# Altium project AMC_uBACKPLANE.PrjPcb (part 1 of 4)
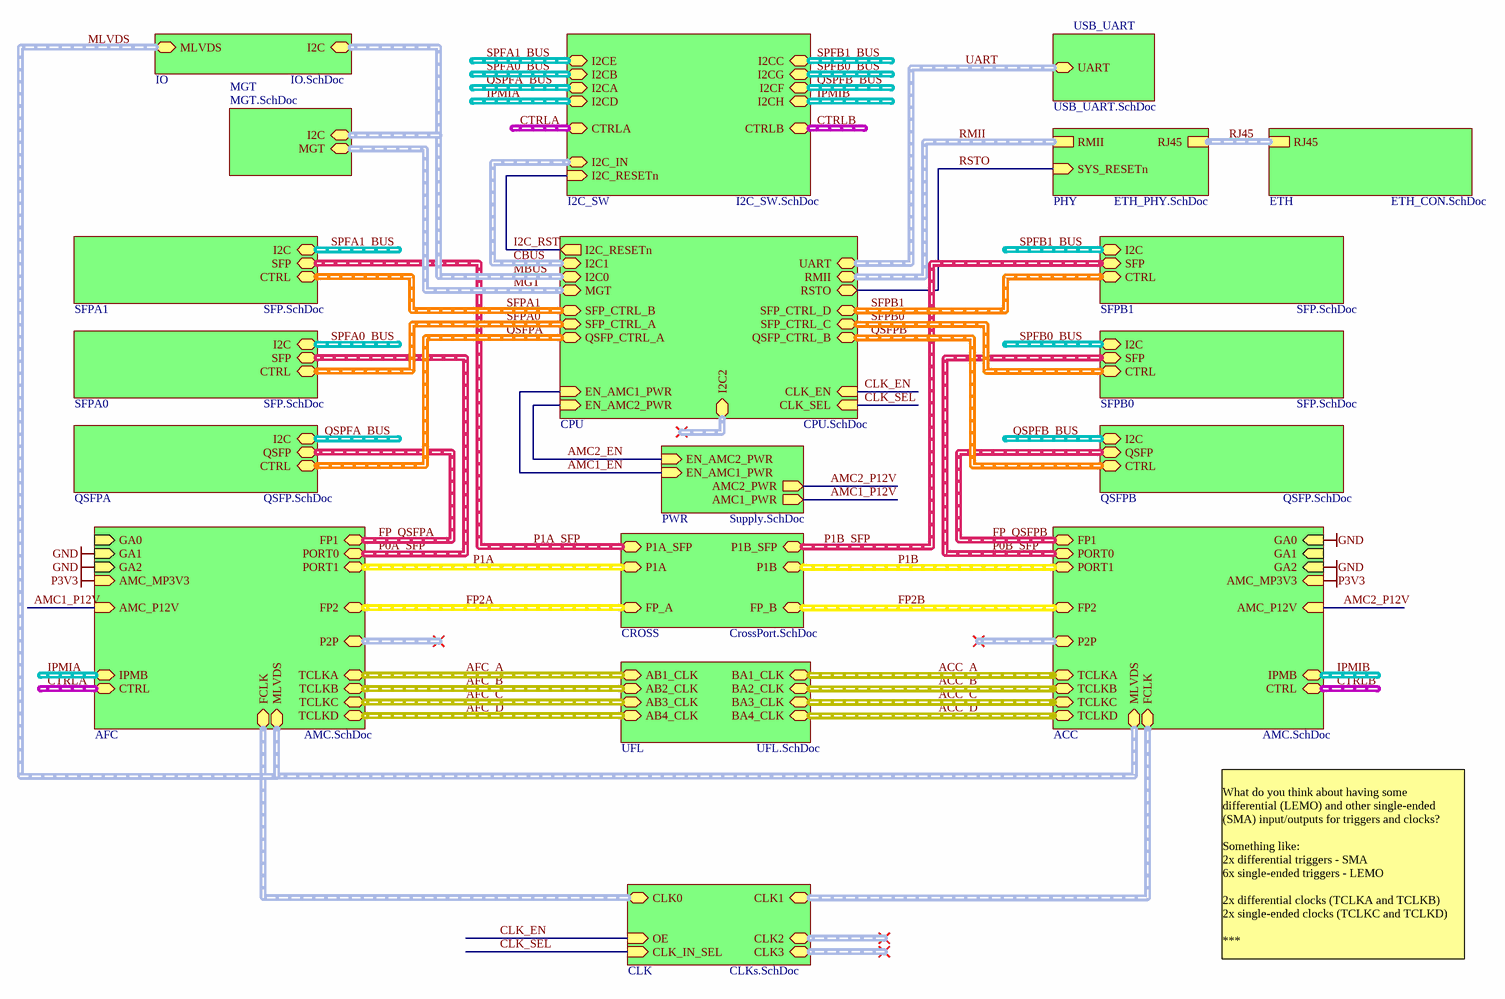
[diagram p0: AMC_uBACKPLANE.SchDoc]
15 sheets, 646 parts. Net scope: hierarchical (ports join the sheet entries above them; power ports are global).
Board file: AMC_uBACKPLANE.PcbDoc
Sheets:
  AMC_uBACKPLANE.SchDoc
    CPU = CPU.SchDoc
    QSFPA = QSFP.SchDoc
    IO = IO.SchDoc
    CLK = CLKs.SchDoc
    QSFPB = QSFP.SchDoc
    SFPA1 = SFP.SchDoc
    ACC = AMC.SchDoc
    AFC = AMC.SchDoc
    SFPA0 = SFP.SchDoc
    SFPB1 = SFP.SchDoc
    SFPB0 = SFP.SchDoc
    UFL = UFL.SchDoc
    CROSS = CrossPort.SchDoc
    PWR = Supply.SchDoc
    USB_UART = USB_UART.SchDoc
    PHY = ETH_PHY.SchDoc
    ETH = ETH_CON.SchDoc
    MGT = MGT.SchDoc
    I2C_SW = I2C_SW.SchDoc

## Sheet AMC_uBACKPLANE.SchDoc: AMC uBACKPLANE
size 420 x 297 mm; Organization: Altium Limited; Address1: L3, 12a Rodborough Rd; Address2: Frenchs Forest; Address3: NSW; Address4: Australia 2086; DocumentNumber: 12; SheetNumber: 1; SheetTotal: 15

### Sub-sheets
ACC = AMC.SchDoc: GA0 (in), GA1 (in), GA2 (in), MLVDS (harness TRG), PORT0 (harness 1xLane), FP2 (harness FP), PORT1 (harness 1xLane), FCLK (harness CLK_DF), TCLKA (harness CLK_DF), TCLKB (harness CLK_DF), TCLKC (harness CLK_DF), TCLKD (harness CLK_DF), FP1 (harness FP), AMC_P12V (in), AMC_MP3V3 (in), IPMB (harness I2C), CTRL (harness AMC_CTRL), P2P (harness P2P)
AFC = AMC.SchDoc: GA0 (in), GA1 (in), GA2 (in), MLVDS (harness TRG), PORT0 (harness 1xLane), FP2 (harness FP), PORT1 (harness 1xLane), FCLK (harness CLK_DF), TCLKA (harness CLK_DF), TCLKB (harness CLK_DF), TCLKC (harness CLK_DF), TCLKD (harness CLK_DF), FP1 (harness FP), AMC_P12V (in), AMC_MP3V3 (in), IPMB (harness I2C), CTRL (harness AMC_CTRL), P2P (harness P2P)
CLK = CLKs.SchDoc: CLK_IN_SEL (in), OE (in), CLK0 (harness CLK_DF), CLK1 (harness CLK_DF), CLK2 (harness CLK_DF), CLK3 (harness CLK_DF)
CPU = CPU.SchDoc: SFP_CTRL_A (harness SFP_CTRL), SFP_CTRL_B (harness SFP_CTRL), SFP_CTRL_C (harness SFP_CTRL), SFP_CTRL_D (harness SFP_CTRL), QSFP_CTRL_A (harness QSFP_CTRL), QSFP_CTRL_B (harness QSFP_CTRL), EN_AMC2_PWR (in), EN_AMC1_PWR (in), CLK_SEL (in), CLK_EN (in), I2C1 (harness I2C), I2C0 (harness I2C), I2C2 (harness I2C), UART (harness UART), RSTO, RMII (harness RMII), MGT (harness THERM_MGT), I2C_RESETn (out)
CROSS = CrossPort.SchDoc: FP_A (harness FP), FP_B (harness FP), P1A (harness 1xLane), P1A_SFP (harness 1xLane), P1B (harness 1xLane), P1B_SFP (harness 1xLane)
ETH = ETH_CON.SchDoc: RJ45 (harness MEDIA)
I2C_SW = I2C_SW.SchDoc: I2C_RESETn (in), I2CE (harness I2C), I2CB (harness I2C), I2CA (harness I2C), I2CD (harness I2C), I2CC (harness I2C), I2CG (harness I2C), I2CF (harness I2C), I2CH (harness I2C), I2C_IN (harness I2C), CTRLA (harness AMC_CTRL), CTRLB (harness AMC_CTRL)
IO = IO.SchDoc: MLVDS (harness MLVDS), I2C (harness I2C)
MGT = MGT.SchDoc: I2C (harness I2C), MGT (harness THERM_MGT)
PHY = ETH_PHY.SchDoc: RMII (harness RMII), RJ45 (harness MEDIA), SYS_RESETn (in)
PWR = Supply.SchDoc: AMC1_PWR (out), AMC2_PWR (out), EN_AMC1_PWR (in), EN_AMC2_PWR (in)
QSFPA = QSFP.SchDoc: I2C (harness I2C), QSFP (harness FP), CTRL (harness QSFP_CTRL)
QSFPB = QSFP.SchDoc: I2C (harness I2C), QSFP (harness FP), CTRL (harness QSFP_CTRL)
SFPA0 = SFP.SchDoc: I2C (harness I2C), SFP (harness 1xLane), CTRL (harness SFP_CTRL)
SFPA1 = SFP.SchDoc: I2C (harness I2C), SFP (harness 1xLane), CTRL (harness SFP_CTRL)
SFPB0 = SFP.SchDoc: I2C (harness I2C), SFP (harness 1xLane), CTRL (harness SFP_CTRL)
SFPB1 = SFP.SchDoc: I2C (harness I2C), SFP (harness 1xLane), CTRL (harness SFP_CTRL)
UFL = UFL.SchDoc: AB1_CLK (harness CLK_DF), BA1_CLK (harness CLK_DF), AB2_CLK (harness CLK_DF), BA2_CLK (harness CLK_DF), AB3_CLK (harness CLK_DF), BA3_CLK (harness CLK_DF), AB4_CLK (harness CLK_DF), BA4_CLK (harness CLK_DF)
USB_UART = USB_UART.SchDoc: UART (harness UART)

### Nets
GND: sheet ACC/GA0, sheet ACC/GA2, sheet AFC/GA1, sheet AFC/GA2
P3V3: sheet ACC/AMC_MP3V3, sheet AFC/AMC_MP3V3
AMC1_EN: sheet CPU/EN_AMC1_PWR, sheet PWR/EN_AMC1_PWR
AMC1_P12V: sheet AFC/AMC_P12V, sheet PWR/AMC1_PWR
AMC2_EN: sheet CPU/EN_AMC2_PWR, sheet PWR/EN_AMC2_PWR
AMC2_P12V: sheet ACC/AMC_P12V, sheet PWR/AMC2_PWR
CLK_EN: sheet CPU/CLK_EN, sheet CLK/OE
CLK_SEL: sheet CPU/CLK_SEL, sheet CLK/CLK_IN_SEL
I2C_RST: sheet CPU/I2C_RESETn, sheet I2C_SW/I2C_RESETn
RSTO: sheet CPU/RSTO, sheet PHY/SYS_RESETn

### Buses and harness runs
harness ACC_A = sheet ACC/TCLKA = sheet UFL/BA1_CLK
harness ACC_B = sheet ACC/TCLKB = sheet UFL/BA2_CLK
harness ACC_C = sheet ACC/TCLKC = sheet UFL/BA3_CLK
harness ACC_D = sheet ACC/TCLKD = sheet UFL/BA4_CLK
harness AFC_A = sheet AFC/TCLKA = sheet UFL/AB1_CLK
harness AFC_B = sheet AFC/TCLKB = sheet UFL/AB2_CLK
harness AFC_C = sheet AFC/TCLKC = sheet UFL/AB3_CLK
harness AFC_D = sheet AFC/TCLKD = sheet UFL/AB4_CLK
harness CBUS = sheet CPU/I2C1 = sheet I2C_SW/I2C_IN
harness CTRLA = sheet AFC/CTRL
harness CTRLA = sheet I2C_SW/CTRLA
harness CTRLB = sheet ACC/CTRL
harness CTRLB = sheet I2C_SW/CTRLB
harness FP2A = sheet AFC/FP2 = sheet CROSS/FP_A
harness FP2B = sheet ACC/FP2 = sheet CROSS/FP_B
harness FP_QSFPA = sheet AFC/FP1 = sheet QSFPA/QSFP
harness FP_QSFPB = sheet ACC/FP1 = sheet QSFPB/QSFP
harness IPMIA = sheet AFC/IPMB
harness IPMIA = sheet I2C_SW/I2CD
harness IPMIB = sheet ACC/IPMB
harness IPMIB = sheet I2C_SW/I2CH
harness MBUS = sheet CPU/I2C0 = sheet IO/I2C = sheet MGT/I2C
harness MGT = sheet CPU/MGT = sheet MGT/MGT
harness MLVDS = sheet ACC/MLVDS = sheet AFC/MLVDS = sheet IO/MLVDS
harness P0A_SFP = sheet AFC/PORT0 = sheet SFPA0/SFP
harness P0B_SFP = sheet ACC/PORT0 = sheet SFPB0/SFP
harness P1A = sheet AFC/PORT1 = sheet CROSS/P1A
harness P1A_SFP = sheet CROSS/P1A_SFP = sheet SFPA1/SFP
harness P1B = sheet ACC/PORT1 = sheet CROSS/P1B
harness P1B_SFP = sheet CROSS/P1B_SFP = sheet SFPB1/SFP
harness QSFPA = sheet CPU/QSFP_CTRL_A = sheet QSFPA/CTRL
harness QSFPB = sheet CPU/QSFP_CTRL_B = sheet QSFPB/CTRL
harness QSPFA_BUS = sheet I2C_SW/I2CA
harness QSPFA_BUS = sheet QSFPA/I2C
harness QSPFB_BUS = sheet I2C_SW/I2CF
harness QSPFB_BUS = sheet QSFPB/I2C
harness RJ45 = sheet ETH/RJ45 = sheet PHY/RJ45
harness RMII = sheet CPU/RMII = sheet PHY/RMII
harness SFPA0 = sheet CPU/SFP_CTRL_A = sheet SFPA0/CTRL
harness SFPA1 = sheet CPU/SFP_CTRL_B = sheet SFPA1/CTRL
harness SFPB0 = sheet CPU/SFP_CTRL_C = sheet SFPB0/CTRL
harness SFPB1 = sheet CPU/SFP_CTRL_D = sheet SFPB1/CTRL
harness sheet ACC/FCLK = sheet CLK/CLK1
harness sheet AFC/FCLK = sheet CLK/CLK0
harness SPFA0_BUS = sheet I2C_SW/I2CB
harness SPFA0_BUS = sheet SFPA0/I2C
harness SPFA1_BUS = sheet I2C_SW/I2CE
harness SPFA1_BUS = sheet SFPA1/I2C
harness SPFB0_BUS = sheet I2C_SW/I2CG
harness SPFB0_BUS = sheet SFPB0/I2C
harness SPFB1_BUS = sheet I2C_SW/I2CC
harness SPFB1_BUS = sheet SFPB1/I2C
harness UART = sheet CPU/UART = sheet USB_UART/UART

### Notes on the sheet
- What do you think about having some differential (LEMO) and other single-ended (SMA) input/outputs for triggers and clocks?
  Something like:
  2x differential triggers - SMA
  6x single-ended triggers - LEMO
  2x differential clocks (TCLKA and TCLKB)
  2x single-ended clocks (TCLKC and TCLKD)
  ***
  Some other things:
  - We can also have access to JTAG and I2C at the front panel.
  - 4x SFP cage could be connected to Port[0..3], as you said before.
  - About the enclosure, do you think it will be needed to design everything, or some parts from Schroff, ELMA, could be used?
- Project/Equipment
- Document
- uTCA RTM 8 SFP+
- Designer
- Drawn by
- Check.by
- Copyright Creotech Instruments SA 2014.
  This documentation describes Open Hardware and is licensed under the CERN OHL v.1.1. You may redistribute and modify this documentation under the terms of the CERN OHL v.1.1. (http://ohwr.org/CERNOHL). This documentation is distributed WITHOUT ANY EXPRESS OR IMPLIED WARRANTY, INCLUDING OF MERCHANTABILITY, SATISFACTORY QUALITY AND FITNESS FOR A PARTICULAR PURPOSE. Please see the CERN OHL v.1.1 for applicable conditions.
- Creotech Instruments S.A.
- File
- Last Mod.
- Print Date
- Sheet
- Size
- A3
- of
- Rev

## Sheet CPU.SchDoc: CPU
size 420 x 297 mm; DocumentNumber: 2; SheetNumber: 3; SheetTotal: 15
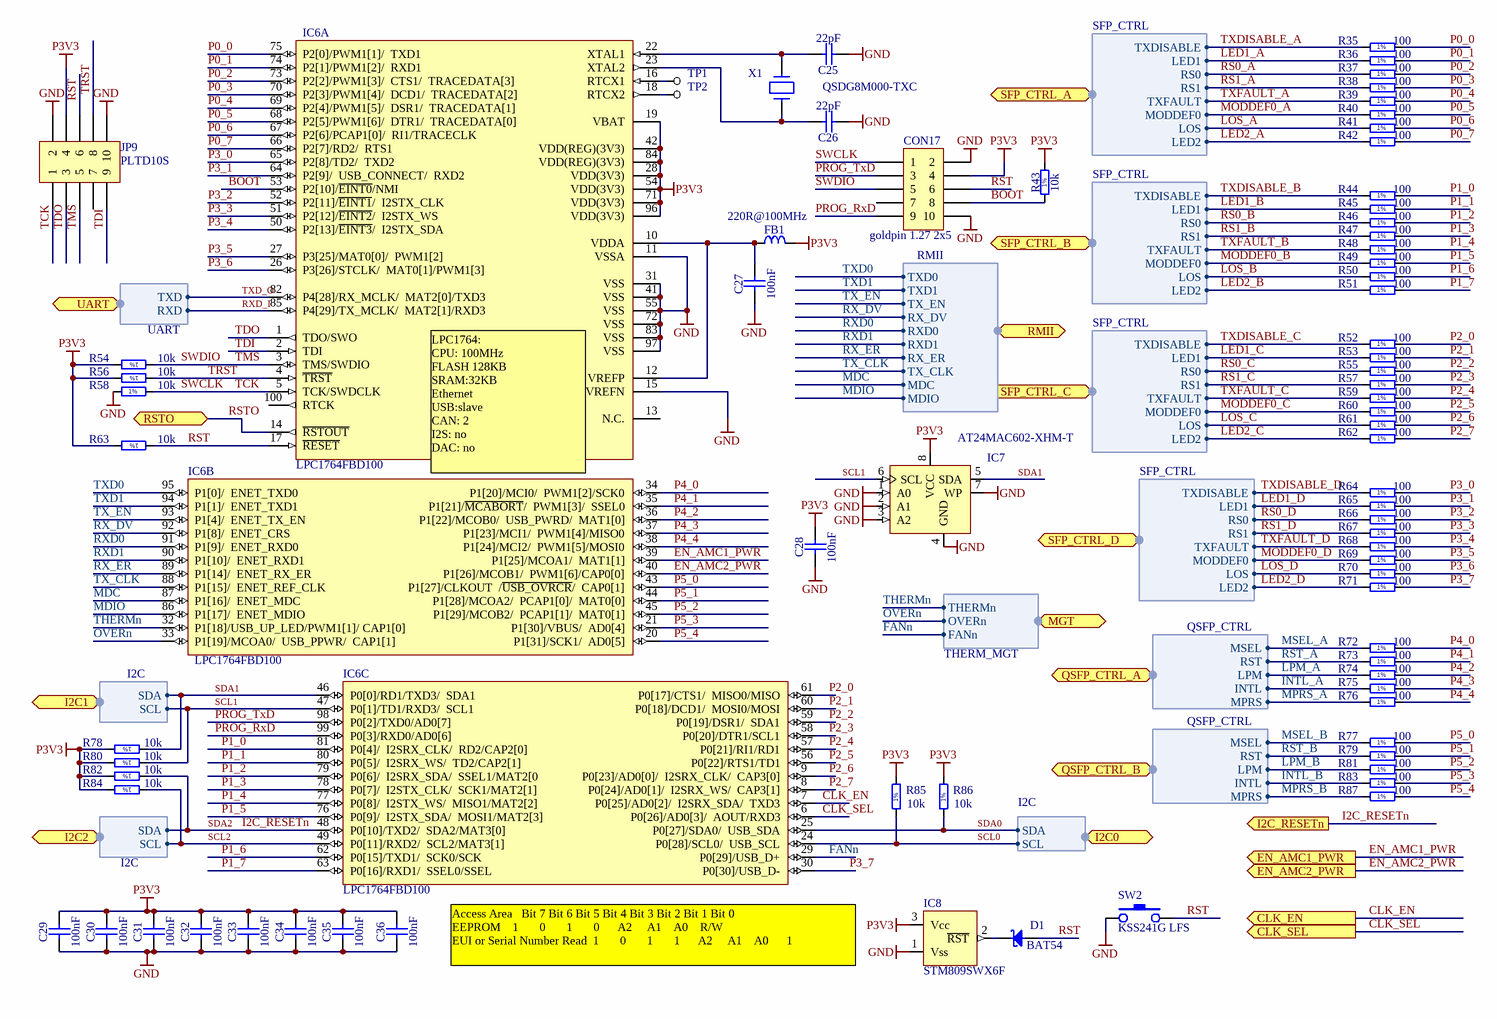
[diagram p1: CPU.SchDoc]

### Parts
C25  22pF  [CAPC1005X55N]
C26  22pF  [CAPC1005X55N]
C27  100nF  [CAPC0603X33N]
C28  100nF  [CAPC0603X33N]
C29  100nF  [CAPC0603X33N]
C30  100nF  [CAPC0603X33N]
C31  100nF  [CAPC0603X33N]
C32  100nF  [CAPC0603X33N]
C33  100nF  [CAPC0603X33N]
C34  100nF  [CAPC0603X33N]
C35  100nF  [CAPC0603X33N]
C36  100nF  [CAPC0603X33N]
CON17  goldpin 1.27 2x5  [CON_2x5_MINI]
D1  BAT54  [SOT95P240X130-3N]
FB1  220R@100MHz  [INDC2012X105N]
IC6  LPC1764FBD100  [LQFP100-LPC]  (parts A,B,C of 3)
IC7  AT24MAC602-XHM-T  [TSSOP-8]
IC8  STM809SWX6F  [SOT-23]
JP9  PLTD10S  [PLTD10S]
R35  100  [RESC1005X40N]
R36  100  [RESC1005X40N]
R37  100  [RESC1005X40N]
R38  100  [RESC1005X40N]
R39  100  [RESC1005X40N]
R40  100  [RESC1005X40N]
R41  100  [RESC1005X40N]
R42  100  [RESC1005X40N]
R43  10k  [RESC1005X40N]
R44  100  [RESC1005X40N]
R45  100  [RESC1005X40N]
R46  100  [RESC1005X40N]
R47  100  [RESC1005X40N]
R48  100  [RESC1005X40N]
R49  100  [RESC1005X40N]
R50  100  [RESC1005X40N]
R51  100  [RESC1005X40N]
R52  100  [RESC1005X40N]
R53  100  [RESC1005X40N]
R54  10k  [RESC1005X40N]
R55  100  [RESC1005X40N]
R56  10k  [RESC1005X40N]
R57  100  [RESC1005X40N]
R58  10k  [RESC1005X40N]
R59  100  [RESC1005X40N]
R60  100  [RESC1005X40N]
R61  100  [RESC1005X40N]
R62  100  [RESC1005X40N]
R63  10k  [RESC1005X40N]
R64  100  [RESC1005X40N]
R65  100  [RESC1005X40N]
R66  100  [RESC1005X40N]
R67  100  [RESC1005X40N]
R68  100  [RESC1005X40N]
R69  100  [RESC1005X40N]
R70  100  [RESC1005X40N]
R71  100  [RESC1005X40N]
R72  100  [RESC1005X40N]
R73  100  [RESC1005X40N]
R74  100  [RESC1005X40N]
R75  100  [RESC1005X40N]
R76  100  [RESC1005X40N]
R77  100  [RESC1005X40N]
R78  10k  [RESC1005X40N]
R79  100  [RESC1005X40N]
R80  10k  [RESC1005X40N]
R81  100  [RESC1005X40N]
R82  10k  [RESC1005X40N]
R83  100  [RESC1005X40N]
R84  10k  [RESC1005X40N]
R85  10k  [RESC1005X40N]
R86  10k  [RESC1005X40N]
R87  100  [RESC1005X40N]
SW2  KSS241G LFS  [KSS241G LFS]
TP1  TP  [TP]  (value not drawn)
TP2  TP  [TP]  (value not drawn)
X1  QSDG8M000-TXC  [XTAL_5.0*3.2]

### Ports
CLK_EN (out), CLK_SEL (out), EN_AMC1_PWR (out), EN_AMC2_PWR (out), I2C0 (harness I2C), I2C1 (harness I2C), I2C2 (harness I2C), I2C_RESETn (out), MGT (harness THERM_MGT), QSFP_CTRL_A (harness QSFP_CTRL), QSFP_CTRL_B (harness QSFP_CTRL), RMII (harness RMII), RSTO, SFP_CTRL_A (harness SFP_CTRL), SFP_CTRL_B (harness SFP_CTRL), SFP_CTRL_C (harness SFP_CTRL), SFP_CTRL_D (harness SFP_CTRL), UART (harness UART)

### Harnesses
I2C: SCL, SDA
UART: RXD, TXD
SFP_CTRL: LED1, TXFAULT, TXDISABLE, MODDEF0, RS0, RS1, LOS, LED2
QSFP_CTRL: RST, MPRS, MSEL, LPM, INTL
RMII: TXD0, TXD1, TX_EN, RX_DV, RXD0, RXD1, RX_ER, TX_CLK, MDC, MDIO
THERM_MGT: OVERn, THERMn, FANn

### Nets
GND: C25.1 C26.1 C27.1 C28.1 C29.1 C30.1 C31.1 C32.1 C33.1 C34.1 C35.1 C36.1 CON17.2 CON17.10 IC6.11(VSSA) IC6.15(VREFN) IC6.31(VSS) IC6.41(VSS) IC6.55(VSS) IC6.72(VSS) IC6.83(VSS) IC6.97(VSS) IC7.1(A0) IC7.2(A1) IC7.3(A2) IC7.4(GND) IC7.7(WP) IC8.1(Vss) JP9.2 JP9.10 R58.1 SW2.1
P3V3: C28.2 C29.2 C30.2 C31.2 C32.2 C33.2 C34.2 C35.2 C36.2 CON17.4 FB1.2 IC6.19(VBAT) IC6.28(VDD(3V3)) IC6.42(VDD(REG)(3V3)) IC6.54(VDD(3V3)) IC6.71(VDD(3V3)) IC6.84(VDD(REG)(3V3)) IC6.96(VDD(3V3)) IC7.8(VCC) IC8.3(Vcc) JP9.4 R43.2 R54.2 R56.2 R63.2 R78.2 R80.2 R82.2 R84.2 R85.2 R86.2
BOOT: CON17.8 IC6.53(P2[10]/~{EINT0}/NMI) R43.1
CLK_EN: IC6.7(P0[25]/AD0[2]/__I2SRX_SDA/__TXD3) ; port CLK_EN
CLK_SEL: IC6.6(P0[26]/AD0[3]/__AOUT/RXD3) ; port CLK_SEL
EN_AMC1_PWR: IC6.39(P1[25]/MCOA1/__MAT1[1]) ; port EN_AMC1_PWR  [project net AMC1_EN]
EN_AMC2_PWR: IC6.40(P1[26]/MCOB1/__PWM1[6]/CAP0[0]) ; port EN_AMC2_PWR  [project net AMC2_EN]
FANn: IC6.29(P0[29]/USB_D+) ; port MGT.FANn  [project net MGT.FANn]
I2C_RESETn: IC6.48(P0[10]/TXD2/__SDA2/MAT3[0]) R82.1 ; port I2C_RESETn, port I2C2.SDA  [also labelled SDA2]  [project net I2C_RST]
INTL_A: R75.1 ; port QSFP_CTRL_A.INTL  [project net QSFPA.INTL]
INTL_B: R83.1 ; port QSFP_CTRL_B.INTL  [project net QSFPB.INTL]
LED1_A: R36.1 ; port SFP_CTRL_A.LED1  [project net SFPA0.LED1]
LED1_B: R45.1 ; port SFP_CTRL_B.LED1  [project net SFPA1.LED1]
LED1_C: R53.1 ; port SFP_CTRL_C.LED1  [project net SFPB0.LED1]
LED1_D: R65.1 ; port SFP_CTRL_D.LED1  [project net SFPB1.LED1]
LED2_A: R42.1 ; port SFP_CTRL_A.LED2  [project net SFPA0.LED2]
LED2_B: R51.1 ; port SFP_CTRL_B.LED2  [project net SFPA1.LED2]
LED2_C: R62.1 ; port SFP_CTRL_C.LED2  [project net SFPB0.LED2]
LED2_D: R71.1 ; port SFP_CTRL_D.LED2  [project net SFPB1.LED2]
LOS_A: R41.1 ; port SFP_CTRL_A.LOS  [project net SFPA0.LOS]
LOS_B: R50.1 ; port SFP_CTRL_B.LOS  [project net SFPA1.LOS]
LOS_C: R61.1 ; port SFP_CTRL_C.LOS  [project net SFPB0.LOS]
LOS_D: R70.1 ; port SFP_CTRL_D.LOS  [project net SFPB1.LOS]
LPM_A: R74.1 ; port QSFP_CTRL_A.LPM  [project net QSFPA.LPM]
LPM_B: R81.1 ; port QSFP_CTRL_B.LPM  [project net QSFPB.LPM]
MDC: IC6.87(P1[16]/__ENET_MDC) ; port RMII.MDC  [project net RMII.MDC]
MDIO: IC6.86(P1[17]/__ENET_MDIO) ; port RMII.MDIO  [project net RMII.MDIO]
MODDEF0_A: R40.1 ; port SFP_CTRL_A.MODDEF0  [project net SFPA0.MODDEF0]
MODDEF0_B: R49.1 ; port SFP_CTRL_B.MODDEF0  [project net SFPA1.MODDEF0]
MODDEF0_C: R60.1 ; port SFP_CTRL_C.MODDEF0  [project net SFPB0.MODDEF0]
MODDEF0_D: R69.1 ; port SFP_CTRL_D.MODDEF0  [project net SFPB1.MODDEF0]
MPRS_A: R76.1 ; port QSFP_CTRL_A.MPRS  [project net QSFPA.MPRS]
MPRS_B: R87.1 ; port QSFP_CTRL_B.MPRS  [project net QSFPB.MPRS]
MSEL_A: R72.1 ; port QSFP_CTRL_A.MSEL  [project net QSFPA.MSEL]
MSEL_B: R77.1 ; port QSFP_CTRL_B.MSEL  [project net QSFPB.MSEL]
OVERn: IC6.33(P1[19]/MCOA0/__USB_PPWR/__CAP1[1]) ; port MGT.OVERn  [project net MGT.OVERn]
P0_0: IC6.75(P2[0]/PWM1[1]/__TXD1) R35.2
P0_1: IC6.74(P2[1]/PWM1[2]/__RXD1) R36.2
P0_2: IC6.73(P2[2]/PWM1[3]/__CTS1/__TRACEDATA[3]) R37.2
P0_3: IC6.70(P2[3]/PWM1[4]/__DCD1/__TRACEDATA[2]) R38.2
P0_4: IC6.69(P2[4]/PWM1[5]/__DSR1/__TRACEDATA[1]) R39.2
P0_5: IC6.68(P2[5]/PWM1[6]/__DTR1/__TRACEDATA[0]) R40.2
P0_6: IC6.67(P2[6]/PCAP1[0]/__RI1/TRACECLK) R41.2
P0_7: IC6.66(P2[7]/RD2/__RTS1) R42.2
P1_0: IC6.81(P0[4]/__I2SRX_CLK/__RD2/CAP2[0]) R44.2
P1_1: IC6.80(P0[5]/__I2SRX_WS/__TD2/CAP2[1]) R45.2
P1_2: IC6.79(P0[6]/__I2SRX_SDA/__SSEL1/MAT2[0) R46.2
P1_3: IC6.78(P0[7]/__I2STX_CLK/__SCK1/MAT2[1]) R47.2
P1_4: IC6.77(P0[8]/__I2STX_WS/__MISO1/MAT2[2]) R48.2
P1_5: IC6.76(P0[9]/__I2STX_SDA/__MOSI1/MAT2[3]) R49.2
P1_6: IC6.62(P0[15]/TXD1/__SCK0/SCK) R50.2
P1_7: IC6.63(P0[16]/RXD1/__SSEL0/SSEL) R51.2
P2_0: IC6.61(P0[17]/CTS1/__MISO0/MISO) R52.2
P2_1: IC6.60(P0[18]/DCD1/__MOSI0/MOSI) R53.2
P2_2: IC6.59(P0[19]/DSR1/__SDA1) R55.2
P2_3: IC6.58(P0[20]/DTR1/SCL1) R57.2
P2_4: IC6.57(P0[21]/RI1/RD1) R59.2
P2_5: IC6.56(P0[22]/RTS1/TD1) R60.2
P2_6: IC6.9(P0[23]/AD0[0]/__I2SRX_CLK/__CAP3[0]) R61.2
P2_7: IC6.8(P0[24]/AD0[1]/__I2SRX_WS/__CAP3[1]) R62.2
P3_0: IC6.65(P2[8]/TD2/__TXD2) R64.2
P3_1: IC6.64(P2[9]/__USB_CONNECT/__RXD2) R65.2
P3_2: IC6.52(P2[11]/~{EINT1}/__I2STX_CLK) R66.2
P3_3: IC6.51(P2[12]/~{EINT2}/__I2STX_WS) R67.2
P3_4: IC6.50(P2[13]/~{EINT3}/__I2STX_SDA) R68.2
P3_5: IC6.27(P3[25]/MAT0[0]/__PWM1[2]) R69.2
P3_6: IC6.26(P3[26]/STCLK/__MAT0[1]/PWM1[3]) R70.2
P3_7: IC6.30(P0[30]/USB_D-) R71.2
P4_0: IC6.34(P1[20]/MCI0/__PWM1[2]/SCK0) R72.2
P4_1: IC6.35(P1[21]/~{MCABORT}/__PWM1[3]/__SSEL0) R73.2
P4_2: IC6.36(P1[22]/MCOB0/__USB_PWRD/__MAT1[0]) R74.2
P4_3: IC6.37(P1[23]/MCI1/__PWM1[4]/MISO0) R75.2
P4_4: IC6.38(P1[24]/MCI2/__PWM1[5]/MOSI0) R76.2
P5_0: IC6.43(P1[27]/CLKOUT__/~{USB_OVRCR}/__CAP0[1]) R77.2
P5_1: IC6.44(P1[28]/MCOA2/__PCAP1[0]/__MAT0[0]) R79.2
P5_2: IC6.45(P1[29]/MCOB2/__PCAP1[1]/__MAT0[1]) R81.2
P5_3: IC6.21(P1[30]/VBUS/__AD0[4]) R83.2
P5_4: IC6.20(P1[31]/SCK1/__AD0[5]) R87.2
PROG_RxD: CON17.9 IC6.99(P0[3]/RXD0/AD0[6])
PROG_TxD: CON17.3 IC6.98(P0[2]/TXD0/AD0[7])
RS0_A: R37.1 ; port SFP_CTRL_A.RS0  [project net SFPA0.RS0]
RS0_B: R46.1 ; port SFP_CTRL_B.RS0  [project net SFPA1.RS0]
RS0_C: R55.1 ; port SFP_CTRL_C.RS0  [project net SFPB0.RS0]
RS0_D: R66.1 ; port SFP_CTRL_D.RS0  [project net SFPB1.RS0]
RS1_A: R38.1 ; port SFP_CTRL_A.RS1  [project net SFPA0.RS1]
RS1_B: R47.1 ; port SFP_CTRL_B.RS1  [project net SFPA1.RS1]
RS1_C: R57.1 ; port SFP_CTRL_C.RS1  [project net SFPB0.RS1]
RS1_D: R67.1 ; port SFP_CTRL_D.RS1  [project net SFPB1.RS1]
RST: CON17.6 D1.1(A) IC6.17(~{RESET}) JP9.6 R63.1 SW2.2
RST_A: R73.1 ; port QSFP_CTRL_A.RST  [project net QSFPA.RST]
RST_B: R79.1 ; port QSFP_CTRL_B.RST  [project net QSFPB.RST]
RSTO: IC6.14(~{RSTOUT}) ; port RSTO
RX_DV: IC6.92(P1[8]/__ENET_CRS) ; port RMII.RX_DV  [project net RMII.RX_DV]
RX_ER: IC6.89(P1[14]/__ENET_RX_ER) ; port RMII.RX_ER  [project net RMII.RX_ER]
RXD0: IC6.91(P1[9]/__ENET_RXD0) ; port RMII.RXD0  [project net RMII.RXD0]
RXD1: IC6.90(P1[10]/__ENET_RXD1) ; port RMII.RXD1  [project net RMII.RXD1]
RXD_I: IC6.85(P4[29]/TX_MCLK/__MAT2[1]/RXD3) ; port UART.RXD  [project net UART.RXD]
SCL0: IC6.24(P0[28]/SCL0/__USB_SCL) R85.1 ; port I2C0.SCL  [project net MBUS.SCL]
SCL1: IC6.47(P0[1]/TD1/RXD3/__SCL1) IC7.6(SCL) R80.1 ; port I2C1.SCL  [project net CBUS.SCL]
SCL2: IC6.49(P0[11]/RXD2/__SCL2/MAT3[1]) R84.1 ; port I2C2.SCL
SDA0: IC6.25(P0[27]/SDA0/__USB_SDA) R86.1 ; port I2C0.SDA  [project net MBUS.SDA]
SDA1: IC6.46(P0[0]/RD1/TXD3/__SDA1) IC7.5(SDA) R78.1 ; port I2C1.SDA  [project net CBUS.SDA]
SWCLK: CON17.1 IC6.5(TCK/SWDCLK) JP9.1 R58.2  [also labelled TCK]
SWDIO: CON17.5 IC6.3(TMS/SWDIO) JP9.5 R54.1  [also labelled TMS]
TDI: IC6.2(TDI) JP9.9
TDO: IC6.1(TDO/SWO) JP9.3
THERMn: IC6.32(P1[18]/USB_UP_LED/PWM1[1]/_CAP1[0]) ; port MGT.THERMn  [project net MGT.THERMn]
TRST: IC6.4(~{TRST}) JP9.8 R56.1
TX_CLK: IC6.88(P1[15]/__ENET_REF_CLK) ; port RMII.TX_CLK  [project net RMII.TX_CLK]
TX_EN: IC6.93(P1[4]/__ENET_TX_EN) ; port RMII.TX_EN  [project net RMII.TX_EN]
TXD0: IC6.95(P1[0]/__ENET_TXD0) ; port RMII.TXD0  [project net RMII.TXD0]
TXD1: IC6.94(P1[1]/__ENET_TXD1) ; port RMII.TXD1  [project net RMII.TXD1]
TXD_O: IC6.82(P4[28]/RX_MCLK/__MAT2[0]/TXD3) ; port UART.TXD  [project net UART.TXD]
TXDISABLE_A: R35.1 ; port SFP_CTRL_A.TXDISABLE  [project net SFPA0.TXDISABLE]
TXDISABLE_B: R44.1 ; port SFP_CTRL_B.TXDISABLE  [project net SFPA1.TXDISABLE]
TXDISABLE_C: R52.1 ; port SFP_CTRL_C.TXDISABLE  [project net SFPB0.TXDISABLE]
TXDISABLE_D: R64.1 ; port SFP_CTRL_D.TXDISABLE  [project net SFPB1.TXDISABLE]
TXFAULT_A: R39.1 ; port SFP_CTRL_A.TXFAULT  [project net SFPA0.TXFAULT]
TXFAULT_B: R48.1 ; port SFP_CTRL_B.TXFAULT  [project net SFPA1.TXFAULT]
TXFAULT_C: R59.1 ; port SFP_CTRL_C.TXFAULT  [project net SFPB0.TXFAULT]
TXFAULT_D: R68.1 ; port SFP_CTRL_D.TXFAULT  [project net SFPB1.TXFAULT]
NetC25_2: C25.2 IC6.22(XTAL1) X1.1
NetC26_2: C26.2 IC6.23(XTAL2) X1.2
NetC27_2: C27.2 FB1.1 IC6.10(VDDA) IC6.12(VREFP)
NetD1_3: D1.3(C) IC8.2(~{RST})
NetIC6_16: IC6.16(RTCX1) TP1.1
NetIC6_18: IC6.18(RTCX2) TP2.1

Not connected (* = marked no-connect by the designer): CON17 7; IC6 13(N.C.) 100(RTCK); JP9 7

### Notes on the sheet
- (near IC6) LPC1764:
  CPU: 100MHz
  FLASH 128KB
  SRAM:32KB
  Ethernet
  USB:slave
  CAN: 2
  I2S: no
  DAC: no
- Access Area 		Bit 7 Bit 6 Bit 5 Bit 4 Bit 3 Bit 2 Bit 1 Bit 0
  EEPROM 			1       0       1       0      A2     A1    A0    R/W
  EUI or Serial Number Read 	1       0       1       1      A2     A1    A0      1
- Project/Equipment
- Document
- uTCA RTM 8 SFP+
- Designer
- Drawn by
- Check.by
- Copyright Creotech Instruments SA 2014.
  This documentation describes Open Hardware and is licensed under the CERN OHL v.1.1. You may redistribute and modify this documentation under the terms of the CERN OHL v.1.1. (http://ohwr.org/CERNOHL). This documentation is distributed WITHOUT ANY EXPRESS OR IMPLIED WARRANTY, INCLUDING OF MERCHANTABILITY, SATISFACTORY QUALITY AND FITNESS FOR A PARTICULAR PURPOSE. Please see the CERN OHL v.1.1 for applicable conditions.
- Creotech Instruments S.A.
- File
- Last Mod.
- Print Date
- Sheet
- Size
- A3
- of
- Rev
- (in symbol R0402_10K_1%_0.0625W_100PPM) 1%
- (in symbol R0402_100R_1%_0.0625W_100PPM) 1%

### Library data of the parts
C25 C26 = CC0402_22PF_50V_5%_NP0: Non-polarised capacitor; Part Description: SMD Multilayer Chip Ceramic Capacitor; Manufacturer: GENERIC; Manufacturer1 Part Number: 223886915229; Voltage: 50V; TC: NP0; Tolerance: ±5%; Table: Capacitors SMD; Part Number: CC0402_22PF_50V_5%_NP0; Component Kind: Standard; Component Type: Standard; Pin Count: 2; Value: 22pF; Status: Not Recommended; Manufacturer Part Number: CC0402_22PF_50V_5%_NP0; Case: 0402; Mounted: Yes; Socket: No; SMD: Yes; Manufacturer1 Example: PHYCOMP; Manufacturer1 ComponentHeight: 0.55mm; HelpURL: \\cern.ch\dfs\Applications\Altium\Datasheets\CC0402_NP0_PHYCOMP.pdf; Author: CERN DEM JLC; CreateDate: 2007-12-03; LatestRevisionDate: 2007-12-03
C27-C36 = CC0201_100NF_6.3V_10%_X5R: Non-polarised capacitor; Part Description: SMD Multilayer Chip Ceramic Capacitor; Manufacturer: GENERIC; Manufacturer1 Part Number: 02016D104KAT2A; Voltage: 6.3V; TC: X5R; Tolerance: ±10%; Table: Capacitors SMD; Part Number: CC0201_100NF_6.3V_10%_X5R; Component Kind: Standard; Component Type: Standard; Pin Count: 2; Value: 100nF; Status: Not Recommended; Manufacturer Part Number: CC0201_100NF_6.3V_10%_X5R; Case: 0201; Mounted: Yes; Socket: No; SMD: Yes; Manufacturer1 Example: AVX; Manufacturer1 ComponentHeight: 0.33mm; HelpURL: \\cern.ch\dfs\Applications\Altium\Datasheets\CC0201_X5R_AVX.pdf; Author: CERN DEM JLC; CreateDate: 2007-12-03; LatestRevisionDate: 2007-12-03
CON17 = CON_HEADER 5X2: PBTD10S
D1 = BAT54: Diode Schottky  Anode Pin 1 Cathode Pin 3 (Pas de pin 2); Part Description: Single Small Signal Schottky Diode; Manufacturer: FAIRCHILD SEMICONDUCTOR; Voltage: 30V; Power: 200mA; Table: Diodes; Part Number: BAT54; Component Kind: Standard; Component Type: Standard; Device: BAT54; PackageDescription: SOT23 3-Leads, Pitch 0.95mm - Body 1.3x2.9mm, IPC Medium Density; Manufacturer Part Number: BAT54; Pin Count: 3; Case: SOT23-3; Mounted: Yes; Socket: No; SMD: Yes; ComponentHeight: 1.30mm; HelpURL: \\cern.ch\dfs\Applications\Altium\Datasheets\BAT54.pdf; Author: CERN DEM JLC; CreateDate: 2009-09-17; LatestRevisionDate: 2010-05-27
FB1 = IND0805_MURATA_BLM21PG221SN1D: Inductor; Part Description: SMD EMIFIL Suppression Chip Ferrite Bead; Manufacturer: MURATA; Power: 2A; Resistance: 0.05R; Tolerance: ±25%; Table: Inductors SMD; Part Number: IND0805_MURATA_BLM21PG221SN1D; Component Kind: Standard; Component Type: Standard; Pin Count: 2; Value: 220R@100MHz; Status: None; Manufacturer Part Number: BLM21PG221SN1D; Case: 0805; Mounted: Yes; Socket: No; SMD: Yes; ComponentHeight: 1.05mm; HelpURL: \\cern.ch\dfs\Applications\Altium\Datasheets\IND0402_MURATA_BLM21P.pdf; Author: CERN DEM JLC; CreateDate: 2010-01-25; LatestRevisionDate: 2010-01-25
IC6 = UPC_LPC1764: ARM Cortex-M3 procesor
IC7 = MEM_24MAC602: Serial 2K EEPROM+ 48bit MAC
IC8 = VMON_STM809: 2.93V  Reset circuit
JP9 = CON_2x5 2.54 male SMT: Goldpin 2.54mm, male header
R35-R42 R44-R53 R55 R57 R59-R62 R64-R77 R79 R81 R83 R87 = R0402_100R_1%_0.0625W_100PPM: Resistor - 1%; Part Description: General Purpose Thick Film Chip Resistor; Manufacturer: GENERIC; Manufacturer1 Part Number: 232270671001L; TC: ±100ppm/°C; Table: Resistors SMD; Part Number: R0402_100R_1%_0.0625W_100PPM; Component Kind: Standard; Component Type: Standard; Pin Count: 2; Value: 100; Status: Not recommended; Power: 0.0625W; Tolerance: ±1%; Manufacturer Part Number: R0402_100R_1%_0.0625W_100PPM; Case: 0402; Mounted: Yes; Socket: No; SMD: Yes; Manufacturer1 Example: YAGEO PHYCOMP; Manufacturer1 ComponentHeight: 0.4mm; HelpURL: \\cern.ch\dfs\Applications\Altium\Datasheets\R0402_Phycomp_RC0402.pdf; Author: CERN DEM JLC; CreateDate: 2007-12-03; LatestRevisionDate: 2012-10-17
R43 R54 R56 R58 R63 R78 R80 R82 R84-R86 = R0402_10K_1%_0.0625W_100PPM: Resistor - 1%; Part Description: General Purpose Thick Film Chip Resistor; Manufacturer: GENERIC; Manufacturer1 Part Number: 232270671003L; TC: ±100ppm/°C; Table: Resistors SMD; Part Number: R0402_10K_1%_0.0625W_100PPM; Component Kind: Standard; Component Type: Standard; Pin Count: 2; Value: 10k; Status: Not recommended; Power: 0.0625W; Tolerance: ±1%; Manufacturer Part Number: R0402_10K_1%_0.0625W_100PPM; Case: 0402; Mounted: Yes; Socket: No; SMD: Yes; Manufacturer1 Example: YAGEO PHYCOMP; Manufacturer1 ComponentHeight: 0.4mm; HelpURL: \\cern.ch\dfs\Applications\Altium\Datasheets\R0402_Phycomp_RC0402.pdf; Author: CERN DEM JLC; CreateDate: 2007-12-03; LatestRevisionDate: 2012-10-17
SW2 = SW-TACT_SMD_RA_mini: Push button; Supplier 1: Farnell; Supplier Part Number 1: 1437640
TP1 TP2 = TP: Testpoint
X1 = X_CRYSTAL_SMD_5.0*3.2: miniature crystal oscillator (Maritex) QSDG8M000-TXC

## Sheet QSFP.SchDoc: QSFP
size 420 x 297 mm; DocumentNumber: 8; SheetNumber: 4; SheetTotal: 15
Used 2 times, as channels QSFPA, QSFPB. Parts and nets are listed once, with the designators drawn on the sheet.
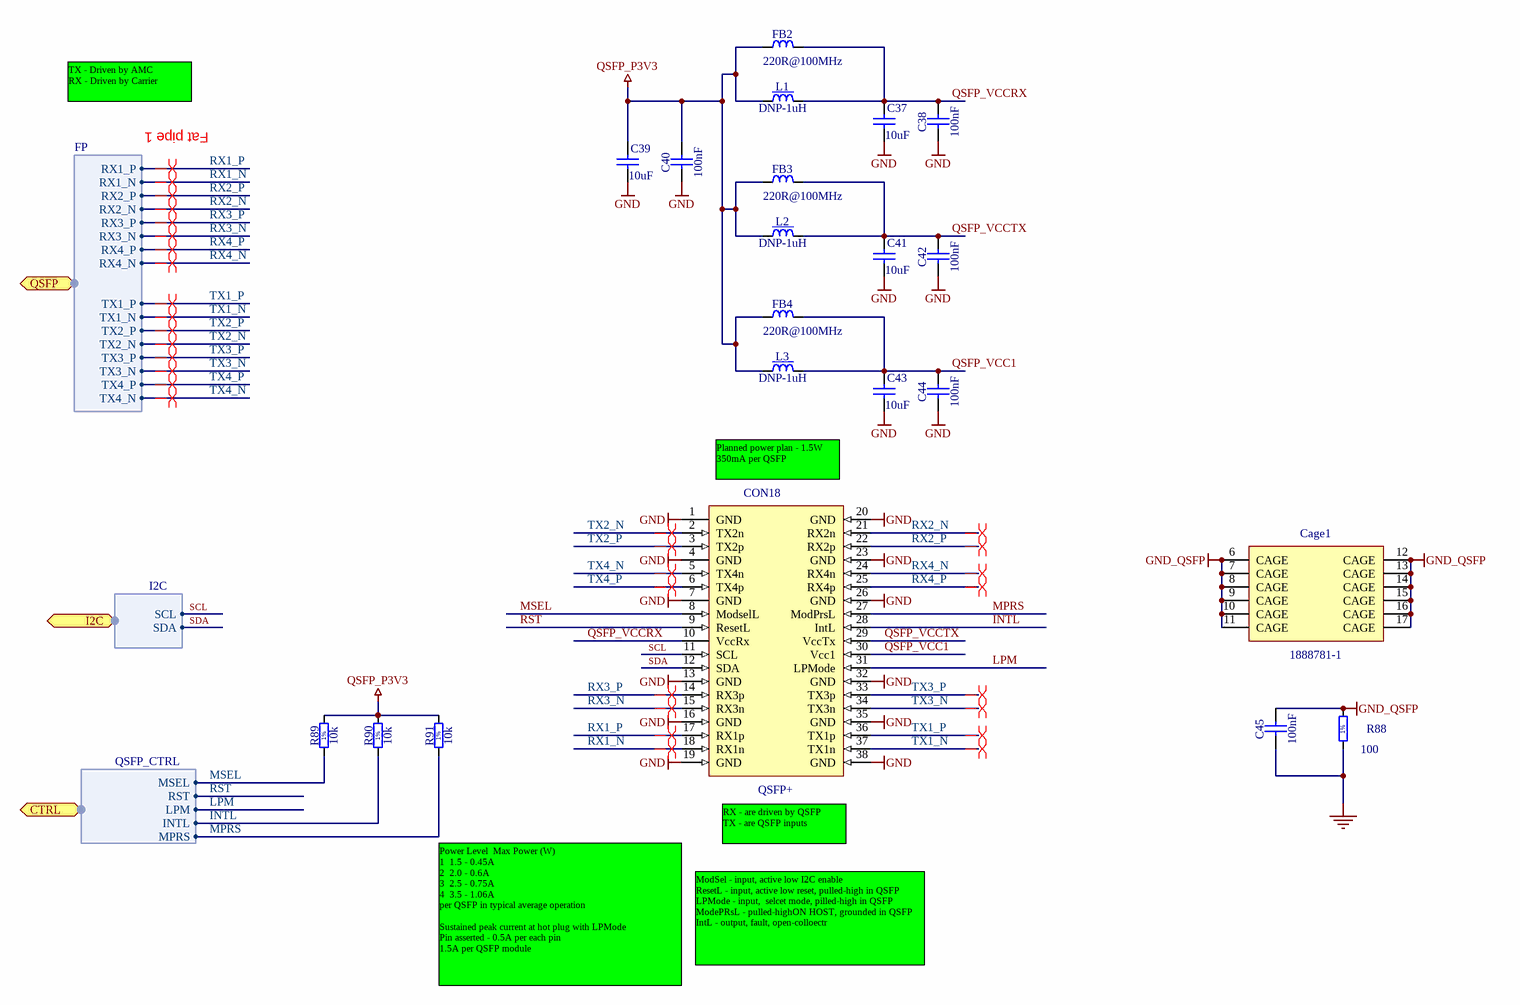
[diagram p2: QSFP.SchDoc]

### Parts
C37  10uF  [CAPC2012X135N]
C38  100nF  [CAPC1005X55N]
C39  10uF  [CAPC2012X135N]
C40  100nF  [CAPC1005X55N]
C41  10uF  [CAPC2012X135N]
C42  100nF  [CAPC1005X55N]
C43  10uF  [CAPC2012X135N]
C44  100nF  [CAPC1005X55N]
C45  100nF  [CAPC1005X55N]
Cage1  1888781-1  [TYCO_1888781-1]
CON18  QSFP+  [TYCO_1761987-9]
FB2  220R@100MHz  [INDC2012X105N]
FB3  220R@100MHz  [INDC2012X105N]
FB4  220R@100MHz  [INDC2012X105N]
L1  DNP-1uH  [IND_MURATA_LQH32]
L2  DNP-1uH  [IND_MURATA_LQH32]
L3  DNP-1uH  [IND_MURATA_LQH32]
R88  100  [RESC1005X40N]
R89  10k  [RESC1005X40N]
R90  10k  [RESC1005X40N]
R91  10k  [RESC1005X40N]

### Ports
CTRL (harness QSFP_CTRL), I2C (harness I2C), QSFP (harness FP)

### Harnesses
I2C: SCL, SDA
FP: RX1_P, RX1_N, RX2_N, RX2_P, TX1_P, TX1_N, TX2_N, TX2_P, RX3_P, RX3_N, RX4_N, RX4_P, TX3_P, TX3_N, TX4_N, TX4_P
QSFP_CTRL: RST, MPRS, MSEL, LPM, INTL

### Nets
GND: C37.2 C38.1 C39.2 C40.1 C41.2 C42.1 C43.2 C44.1 C45.1 CON18.1(GND) CON18.4(GND) CON18.7(GND) CON18.13(GND) CON18.16(GND) CON18.19(GND) CON18.20(GND) CON18.23(GND) CON18.26(GND) CON18.32(GND) CON18.35(GND) CON18.38(GND) R88.1
GND_QSFP: C45.2 Cage1.6(CAGE) Cage1.7(CAGE) Cage1.8(CAGE) Cage1.9(CAGE) Cage1.10(CAGE) Cage1.11(CAGE) Cage1.12(CAGE) Cage1.13(CAGE) Cage1.14(CAGE) Cage1.15(CAGE) Cage1.16(CAGE) Cage1.17(CAGE) R88.2
QSFP_P3V3: C39.1 C40.2 FB2.1 FB3.1 FB4.1 L1.1 L2.1 L3.1 R89.2 R90.2 R91.2
INTL: CON18.28(IntL) R90.1 ; port CTRL.INTL
LPM: CON18.31(LPMode) ; port CTRL.LPM
MPRS: CON18.27(ModPrsL) R91.1 ; port CTRL.MPRS
MSEL: CON18.8(ModselL) R89.1 ; port CTRL.MSEL
QSFP_VCC1: C43.1 C44.2 CON18.30(Vcc1) FB4.2 L3.2
QSFP_VCCRX: C37.1 C38.2 CON18.10(VccRx) FB2.2 L1.2
QSFP_VCCTX: C41.1 C42.2 CON18.29(VccTx) FB3.2 L2.2
RST: CON18.9(ResetL) ; port CTRL.RST
RX1_N: CON18.18(RX1n) ; port QSFP.RX1_N
RX1_P: CON18.17(RX1p) ; port QSFP.RX1_P
RX2_N: CON18.21(RX2n) ; port QSFP.RX2_N
RX2_P: CON18.22(RX2p) ; port QSFP.RX2_P
RX3_N: CON18.15(RX3n) ; port QSFP.RX3_N
RX3_P: CON18.14(RX3p) ; port QSFP.RX3_P
RX4_N: CON18.24(RX4n) ; port QSFP.RX4_N
RX4_P: CON18.25(RX4p) ; port QSFP.RX4_P
SCL: CON18.11(SCL) ; port I2C.SCL
SDA: CON18.12(SDA) ; port I2C.SDA
TX1_N: CON18.37(TX1n) ; port QSFP.TX1_N
TX1_P: CON18.36(TX1p) ; port QSFP.TX1_P
TX2_N: CON18.2(TX2n) ; port QSFP.TX2_N
TX2_P: CON18.3(TX2p) ; port QSFP.TX2_P
TX3_N: CON18.34(TX3n) ; port QSFP.TX3_N
TX3_P: CON18.33(TX3p) ; port QSFP.TX3_P
TX4_N: CON18.5(TX4n) ; port QSFP.TX4_N
TX4_P: CON18.6(TX4p) ; port QSFP.TX4_P

### Channels
QSFPA: designators end in A
QSFPB: designators end in B

### Layout directives
differential pair: FP_QSFPA.RX1_N, FP_QSFPA.RX1_P, FP_QSFPA.RX2_N, FP_QSFPA.RX2_P, FP_QSFPA.RX3_N, FP_QSFPA.RX3_P, FP_QSFPA.RX4_N, FP_QSFPA.RX4_P, FP_QSFPA.TX1_N, FP_QSFPA.TX1_P, FP_QSFPA.TX2_N, FP_QSFPA.TX2_P, FP_QSFPA.TX3_N, FP_QSFPA.TX3_P, FP_QSFPA.TX4_N, FP_QSFPA.TX4_P

### Notes on the sheet
- TX - Driven by AMC
  RX - Driven by Carrier
- Fat pipe 1
- Planned power plan - 1.5W
  350mA per QSFP
- (near CON18) RX - are driven by QSFP
  TX - are QSFP inputs
- ModSel - input, active low I2C enable
  ResetL - input, active low reset, pulled-high in QSFP
  LPMode - input,  selcet mode, pilled-high in QSFP
  ModePRsL - pulled-highON HOST, grounded in QSFP
  IntL - output, fault, open-colloectr
- Power Level  Max Power (W)
  1  1.5 - 0.45A
  2  2.0 - 0.6A
  3  2.5 - 0.75A
  4  3.5 - 1.06A
  per QSFP in typical average operation
  Sustained peak current at hot plug with LPMode
  Pin asserted - 0.5A per each pin
  1.5A per QSFP module
- Project/Equipment
- Document
- uTCA RTM 8 SFP+
- Designer
- Drawn by
- Check.by
- Copyright Creotech Instruments SA 2014.
  This documentation describes Open Hardware and is licensed under the CERN OHL v.1.1. You may redistribute and modify this documentation under the terms of the CERN OHL v.1.1. (http://ohwr.org/CERNOHL). This documentation is distributed WITHOUT ANY EXPRESS OR IMPLIED WARRANTY, INCLUDING OF MERCHANTABILITY, SATISFACTORY QUALITY AND FITNESS FOR A PARTICULAR PURPOSE. Please see the CERN OHL v.1.1 for applicable conditions.
- Creotech Instruments S.A.
- File
- Last Mod.
- Print Date
- Sheet
- Size
- A3
- of
- Rev
- (in symbol R0402_10K_1%_0.0625W_100PPM) 1%
- (in symbol R0402_100R_1%_0.0625W_100PPM) 1%

### Library data of the parts
C37 C39 C41 C43 = CC0805_10UF_10V_10%_X7R: Non-polarised capacitor; Part Description: SMD Multilayer Chip Ceramic Capacitor; Manufacturer: GENERIC; Manufacturer1 Part Number: GRM21BR71A106KE51L; Voltage: 10V; TC: X7R; Tolerance: ±10%; Table: Capacitors SMD; Part Number: CC0805_10UF_10V_10%_X7R; Component Kind: Standard; Component Type: Standard; Pin Count: 2; Value: 10uF; Status: Preferred; Manufacturer Part Number: CC0805_10UF_10V_10%_X7R; Case: 0805; Mounted: Yes; Socket: No; SMD: Yes; Manufacturer1 Example: MURATA; Manufacturer1 ComponentHeight: 1.35mm; HelpURL: \\cern.ch\dfs\Applications\Altium\Datasheets\CC0805_X7R_MURATA.pdf; Author: CERN DEM JLC; CreateDate: 2012-04-30; LatestRevisionDate: 2012-04-30
C38 C40 C42 C44 C45 = CC0402_100NF_16V_10%_X5R: Non-polarised capacitor; Part Description: SMD Multilayer Chip Ceramic Capacitor; Manufacturer: GENERIC; Manufacturer1 Part Number: GRM155R61C104KA88D; Voltage: 16V; TC: X5R; Tolerance: ±10%; Table: Capacitors SMD; Part Number: CC0402_100NF_16V_10%_X5R; Component Kind: Standard; Component Type: Standard; Pin Count: 2; Value: 100nF; Status: None; Manufacturer Part Number: CC0402_100NF_16V_10%_X5R; Case: 0402; Mounted: Yes; Socket: No; SMD: Yes; Manufacturer1 Example: MURATA; Manufacturer1 ComponentHeight: 0.55mm; HelpURL: \\cern.ch\dfs\Applications\Altium\Datasheets\CC0402_X5R_MURATA_GRM.pdf; Author: CERN DEM JLC; CreateDate: 2013-12-10; LatestRevisionDate: 2013-12-10
Cage1 = CON_QSFP+_cage: QSFP+ 1x3 Cage (23Pins); Part Number: TYCO_2007456-1; Part Description: 1x3 Press Fit Cage+ Heat Sink For Use with QSFP+ Connector (Quad Small Form-factor Pluggable); Manufacturer: TYCO ELECTRONICS; Manufacturer Part Number: 2007456-1; Table: TYCO; Component Kind: Standard; Component Type: Standard; Footprint: TYCO_2007456-1; Pin Count: 23; Family: QSFP+; Mounted: Yes; Socket: No; SMD: No; Status: None; ComponentHeight: 13.2mm; HelpURL: \\cern.ch\dfs\Applications\Altium\Datasheets\TYCO_2007456-1.pdf; Author: CERN DEM JLC; CreateDate: 2013-07-15; LatestRevisionDate: 2013-07-15
CON18 = TYCO_1761987-9: 38Position QSFP Connector  (Quad Small Form-factor Pluggable); Part Description: Surface Mount EVERCLEAR Mini-SAS Right Angle QSFP Host Connector; Manufacturer: TYCO ELECTRONICS; Table: TYCO; Part Number: TYCO_1761987-9; Component Kind: Standard; Component Type: Standard; Pin Count: 38; Family: QSFP+; Mounted: Yes; Socket: No; SMD: No; Status: None; Manufacturer Part Number: 1761987-9; ComponentHeight: 5.55mm; HelpURL: \\cern.ch\dfs\Applications\Altium\Datasheets\TYCO_1761987-9.pdf; Author: CERN DEM JLC; CreateDate: 2013-07-15; LatestRevisionDate: 2013-07-15
FB2-FB4 = IND0805_MURATA_BLM21PG221SN1D: as FB1 on sheet CPU; Part Number: IND0805_MURATA_BLM21PG221SN1D; Component Kind: Standard; Component Type: Standard; Pin Count: 2; Value: 220R@100MHz; Status: None; Manufacturer Part Number: BLM21PG221SN1D; Case: 0805; Mounted: Yes; Socket: No; SMD: Yes; ComponentHeight: 1.05mm; HelpURL: \\cern.ch\dfs\Applications\Altium\Datasheets\IND0402_MURATA_BLM21P.pdf; Author: CERN DEM JLC; CreateDate: 2010-01-25; LatestRevisionDate: 2010-01-25
L1-L3 = IND_1UH_20%_MURATA_LQH32CN1R0M33: Inductor With Magnetic core; Part Description: Chip Inductor (Chip Coil) for Choke Wire Wound Type; Manufacturer: MURATA; Manufacturer Part Number: LQH32CN1R0M33L; Power: 1A; Resistance: 0.06R; Tolerance: ±20%; Table: Inductors SMD; Part Number: IND_1UH_20%_MURATA_LQH32CN1R0M33; Component Kind: Standard; Component Type: Standard; Pin Count: 2; Value: DNP-1uH; Status: None; Mounted: Yes; Socket: No; SMD: Yes; ComponentHeight: 2.2mm; HelpURL: \\cern.ch\dfs\Applications\Altium\Datasheets\IND_MURATA_LQH32.pdf; Author: CERN DEM JLC; CreateDate: 2012-08-14; LatestRevisionDate: 2012-08-20
R88 = R0402_100R_1%_0.0625W_100PPM: as R35 on sheet CPU; Part Number: R0402_100R_1%_0.0625W_100PPM; Component Kind: Standard; Component Type: Standard; Pin Count: 2; Value: 100; Status: Not recommended; Power: 0.0625W; Tolerance: ±1%; Manufacturer Part Number: R0402_100R_1%_0.0625W_100PPM; Case: 0402; Mounted: Yes; Socket: No; SMD: Yes; Manufacturer1 Example: YAGEO PHYCOMP; Manufacturer1 ComponentHeight: 0.4mm; HelpURL: \\cern.ch\dfs\Applications\Altium\Datasheets\R0402_Phycomp_RC0402.pdf; Author: CERN DEM JLC; CreateDate: 2007-12-03; LatestRevisionDate: 2012-10-17
R89-R91 = R0402_10K_1%_0.0625W_100PPM: as R43 on sheet CPU; Part Number: R0402_10K_1%_0.0625W_100PPM; Component Kind: Standard; Component Type: Standard; Pin Count: 2; Value: 10k; Status: Not recommended; Power: 0.0625W; Tolerance: ±1%; Manufacturer Part Number: R0402_10K_1%_0.0625W_100PPM; Case: 0402; Mounted: Yes; Socket: No; SMD: Yes; Manufacturer1 Example: YAGEO PHYCOMP; Manufacturer1 ComponentHeight: 0.4mm; HelpURL: \\cern.ch\dfs\Applications\Altium\Datasheets\R0402_Phycomp_RC0402.pdf; Author: CERN DEM JLC; CreateDate: 2007-12-03; LatestRevisionDate: 2012-10-17

## Sheet IO.SchDoc: IO
size 420 x 297 mm; DocumentNumber: 6; SheetNumber: 2; SheetTotal: 15
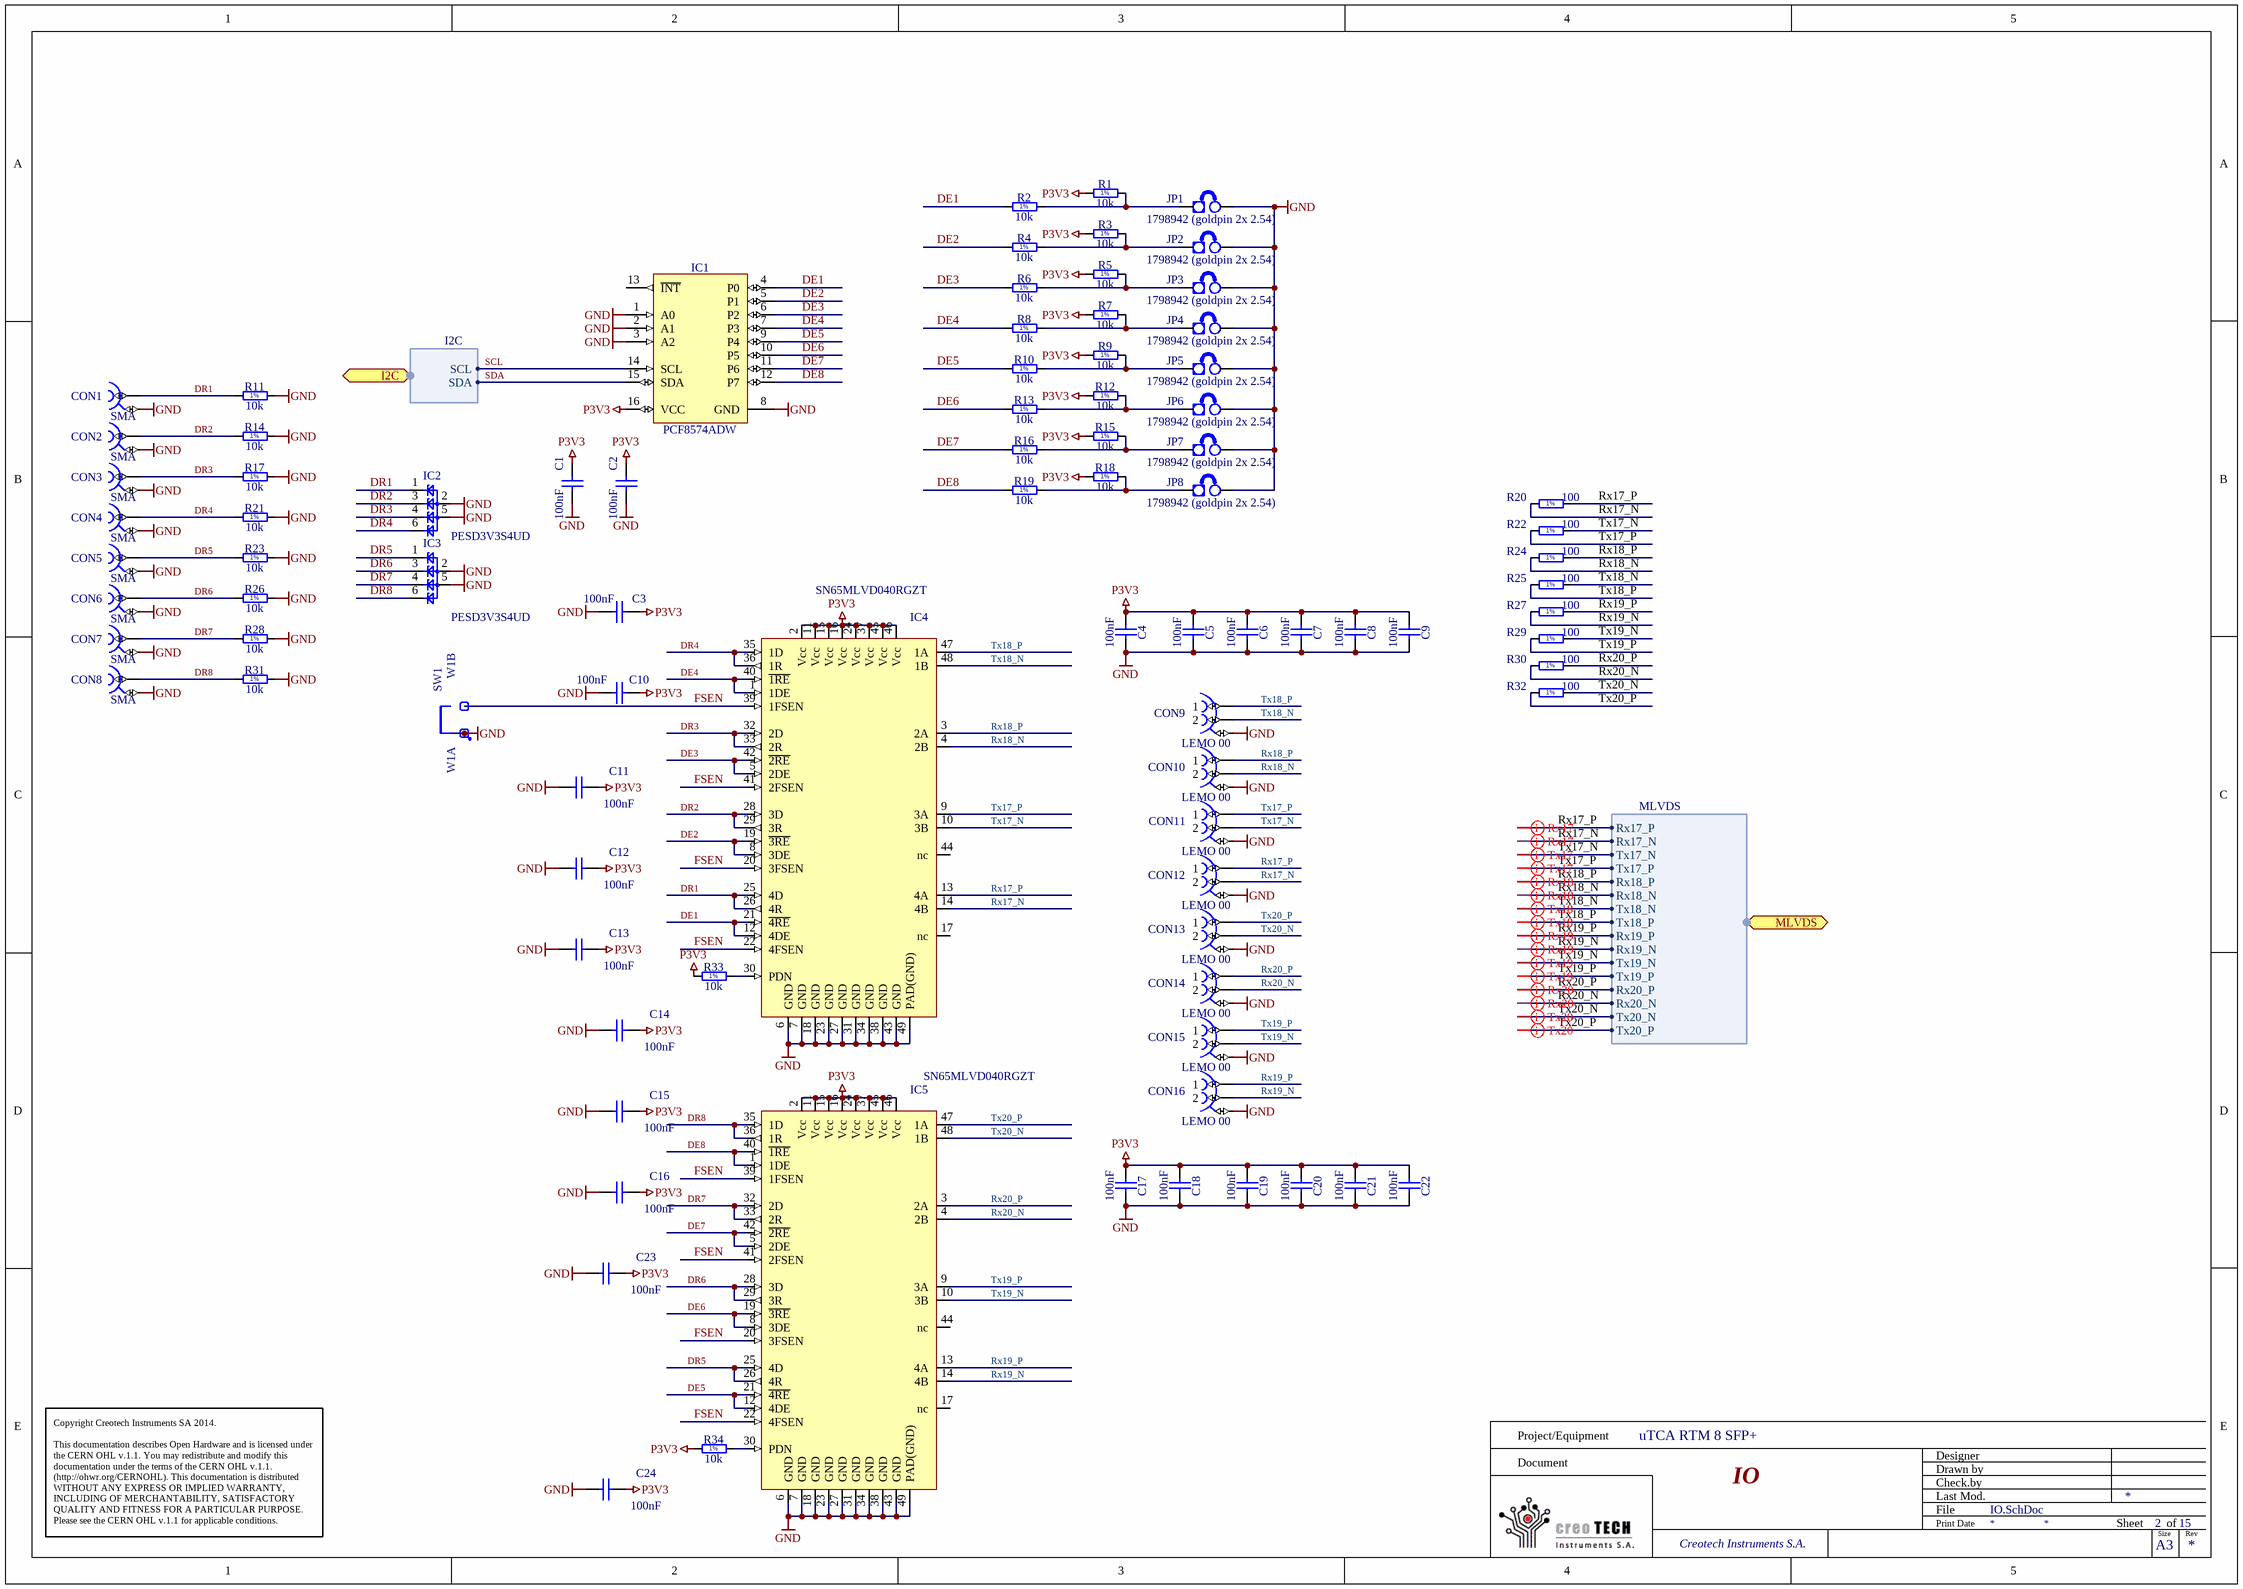
[diagram p3: IO.SchDoc]

### Parts
C1  100nF  [CAPC0603X33N]
C2  100nF  [CAPC0603X33N]
C3  100nF  [CAPC0603X33N]
C4  100nF  [CAPC0603X33N]
C5  100nF  [CAPC0603X33N]
C6  100nF  [CAPC0603X33N]
C7  100nF  [CAPC0603X33N]
C8  100nF  [CAPC0603X33N]
C9  100nF  [CAPC0603X33N]
C10  100nF  [CAPC0603X33N]
C11  100nF  [CAPC0603X33N]
C12  100nF  [CAPC0603X33N]
C13  100nF  [CAPC0603X33N]
C14  100nF  [CAPC0603X33N]
C15  100nF  [CAPC0603X33N]
C16  100nF  [CAPC0603X33N]
C17  100nF  [CAPC0603X33N]
C18  100nF  [CAPC0603X33N]
C19  100nF  [CAPC0603X33N]
C20  100nF  [CAPC0603X33N]
C21  100nF  [CAPC0603X33N]
C22  100nF  [CAPC0603X33N]
C23  100nF  [CAPC0603X33N]
C24  100nF  [CAPC0603X33N]
CON1  SMA  [HUBER-SUHNER_85 SMA-50-0-101/111 NE]
CON2  SMA  [HUBER-SUHNER_85 SMA-50-0-101/111 NE]
CON3  SMA  [HUBER-SUHNER_85 SMA-50-0-101/111 NE]
CON4  SMA  [HUBER-SUHNER_85 SMA-50-0-101/111 NE]
CON5  SMA  [HUBER-SUHNER_85 SMA-50-0-101/111 NE]
CON6  SMA  [HUBER-SUHNER_85 SMA-50-0-101/111 NE]
CON7  SMA  [HUBER-SUHNER_85 SMA-50-0-101/111 NE]
CON8  SMA  [HUBER-SUHNER_85 SMA-50-0-101/111 NE]
CON9  LEMO 00  [LEMO_EPG.00.302.NLN]
CON10  LEMO 00  [LEMO_EPG.00.302.NLN]
CON11  LEMO 00  [LEMO_EPG.00.302.NLN]
CON12  LEMO 00  [LEMO_EPG.00.302.NLN]
CON13  LEMO 00  [LEMO_EPG.00.302.NLN]
CON14  LEMO 00  [LEMO_EPG.00.302.NLN]
CON15  LEMO 00  [LEMO_EPG.00.302.NLN]
CON16  LEMO 00  [LEMO_EPG.00.302.NLN]
IC1  PCF8574ADW  [SOIC127P1030X265-16N]
IC2  PESD3V3S4UD  [SOT457]
IC3  PESD3V3S4UD  [SOT457]
IC4  SN65MLVD040RGZT  [QFN48L]
IC5  SN65MLVD040RGZT  [QFN48L]
JP1  1798942 (goldpin 2x 2.54)  [HEADER2x1 2.54mm]
JP2  1798942 (goldpin 2x 2.54)  [HEADER2x1 2.54mm]
JP3  1798942 (goldpin 2x 2.54)  [HEADER2x1 2.54mm]
JP4  1798942 (goldpin 2x 2.54)  [HEADER2x1 2.54mm]
JP5  1798942 (goldpin 2x 2.54)  [HEADER2x1 2.54mm]
JP6  1798942 (goldpin 2x 2.54)  [HEADER2x1 2.54mm]
JP7  1798942 (goldpin 2x 2.54)  [HEADER2x1 2.54mm]
JP8  1798942 (goldpin 2x 2.54)  [HEADER2x1 2.54mm]
R1  10k  [RESC1005X40N]
R2  10k  [RESC1005X40N]
R3  10k  [RESC1005X40N]
R4  10k  [RESC1005X40N]
R5  10k  [RESC1005X40N]
R6  10k  [RESC1005X40N]
R7  10k  [RESC1005X40N]
R8  10k  [RESC1005X40N]
R9  10k  [RESC1005X40N]
R10  10k  [RESC1005X40N]
R11  10k  [RESC1005X40N]
R12  10k  [RESC1005X40N]
R13  10k  [RESC1005X40N]
R14  10k  [RESC1005X40N]
R15  10k  [RESC1005X40N]
R16  10k  [RESC1005X40N]
R17  10k  [RESC1005X40N]
R18  10k  [RESC1005X40N]
R19  10k  [RESC1005X40N]
R20  100  [RESC1005X40N]
R21  10k  [RESC1005X40N]
R22  100  [RESC1005X40N]
R23  10k  [RESC1005X40N]
R24  100  [RESC1005X40N]
R25  100  [RESC1005X40N]
R26  10k  [RESC1005X40N]
R27  100  [RESC1005X40N]
R28  10k  [RESC1005X40N]
R29  100  [RESC1005X40N]
R30  100  [RESC1005X40N]
R31  10k  [RESC1005X40N]
R32  100  [RESC1005X40N]
R33  10k  [RESC1005X40N]
R34  10k  [RESC1005X40N]
SW1  Jumper Type1  [JUMPER_BLACK_INSULATED_2.54MM]  (value not drawn)
W1  Test Point  [COMATEL_385.0358.1.02.400]  (value not drawn)  (parts A,B of 2)

### Ports
I2C (harness I2C), MLVDS (harness MLVDS)

### Harnesses
MLVDS: Rx17_P, Rx17_N, Tx17_N, Tx17_P, Rx18_P, Rx18_N, Tx18_N, Tx18_P, Rx19_P, Rx19_N, Tx19_N, Tx19_P, Rx20_P, Rx20_N, Tx20_N, Tx20_P
I2C: SCL, SDA

### Nets
GND: C1.1 C2.1 C3.1 C4.2 C5.2 C6.2 C7.2 C8.2 C9.2 C10.1 C11.2 C12.2 C13.2 C14.2 C15.2 C16.2 C17.2 C18.2 C19.2 C20.2 C21.2 C22.2 C23.2 C24.2 CON1.2 CON2.2 CON3.2 CON4.2 CON5.2 CON6.2 CON7.2 CON8.2 CON9.3 CON10.3 CON11.3 CON12.3 CON13.3 CON14.3 CON15.3 CON16.3 IC1.1(A0) IC1.2(A1) IC1.3(A2) IC1.8(GND) IC2.2 IC2.5 IC3.2 IC3.5 IC4.6(GND) IC4.7(GND) IC4.18(GND) IC4.23(GND) IC4.27(GND) IC4.31(GND) IC4.34(GND) IC4.38(GND) IC4.43(GND) IC4.49(PAD(GND)) IC5.6(GND) IC5.7(GND) IC5.18(GND) IC5.23(GND) IC5.27(GND) IC5.31(GND) IC5.34(GND) IC5.38(GND) IC5.43(GND) IC5.49(PAD(GND)) JP1.2(E2) JP2.2(E2) JP3.2(E2) JP4.2(E2) JP5.2(E2) JP6.2(E2) JP7.2(E2) JP8.2(E2) R11.2 R14.2 R17.2 R21.2 R23.2 R26.2 R28.2 R31.2 SW1.1 W1.1
P3V3: C1.2 C2.2 C3.2 C4.1 C5.1 C6.1 C7.1 C8.1 C9.1 C10.2 C11.1 C12.1 C13.1 C14.1 C15.1 C16.1 C17.1 C18.1 C19.1 C20.1 C21.1 C22.1 C23.1 C24.1 IC1.16(VCC) IC4.2(Vcc) IC4.11(Vcc) IC4.15(Vcc) IC4.16(Vcc) IC4.24(Vcc) IC4.37(Vcc) IC4.45(Vcc) IC4.46(Vcc) IC5.2(Vcc) IC5.11(Vcc) IC5.15(Vcc) IC5.16(Vcc) IC5.24(Vcc) IC5.37(Vcc) IC5.45(Vcc) IC5.46(Vcc) R1.1 R3.1 R5.1 R7.1 R9.1 R12.1 R15.1 R18.1 R33.1 R34.1
DE1: IC1.4(P0) IC4.12(4DE) IC4.21(~{4RE}) R2.1
DE2: IC1.5(P1) IC4.8(3DE) IC4.19(~{3RE}) R4.1
DE3: IC1.6(P2) IC4.5(2DE) IC4.42(~{2RE}) R6.1
DE4: IC1.7(P3) IC4.1(1DE) IC4.40(~{1RE}) R8.1
DE5: IC1.9(P4) IC5.12(4DE) IC5.21(~{4RE}) R10.1
DE6: IC1.10(P5) IC5.8(3DE) IC5.19(~{3RE}) R13.1
DE7: IC1.11(P6) IC5.5(2DE) IC5.42(~{2RE}) R16.1
DE8: IC1.12(P7) IC5.1(1DE) IC5.40(~{1RE}) R19.1
DR1: CON1.1 IC2.1 IC4.25(4D) IC4.26(4R) R11.1
DR2: CON2.1 IC2.3 IC4.28(3D) IC4.29(3R) R14.1
DR3: CON3.1 IC2.4 IC4.32(2D) IC4.33(2R) R17.1
DR4: CON4.1 IC2.6 IC4.35(1D) IC4.36(1R) R21.1
DR5: CON5.1 IC3.1 IC5.25(4D) IC5.26(4R) R23.1
DR6: CON6.1 IC3.3 IC5.28(3D) IC5.29(3R) R26.1
DR7: CON7.1 IC3.4 IC5.32(2D) IC5.33(2R) R28.1
DR8: CON8.1 IC3.6 IC5.35(1D) IC5.36(1R) R31.1
FSEN: IC4.20(3FSEN) IC4.22(4FSEN) IC4.39(1FSEN) IC4.41(2FSEN) IC5.20(3FSEN) IC5.22(4FSEN) IC5.39(1FSEN) IC5.41(2FSEN) W1.2
Rx17_N: CON12.2 IC4.14(4B) R20.1 ; port MLVDS.Rx17_N  [project net MLVDS.Rx17_N]
Rx17_P: CON12.1 IC4.13(4A) R20.2 ; port MLVDS.Rx17_P  [project net MLVDS.Rx17_P]
Rx18_N: CON10.2 IC4.4(2B) R24.1 ; port MLVDS.Rx18_N  [project net MLVDS.Rx18_N]
Rx18_P: CON10.1 IC4.3(2A) R24.2 ; port MLVDS.Rx18_P  [project net MLVDS.Rx18_P]
Rx19_N: CON16.2 IC5.14(4B) R27.1 ; port MLVDS.Rx19_N  [project net MLVDS.Rx19_N]
Rx19_P: CON16.1 IC5.13(4A) R27.2 ; port MLVDS.Rx19_P  [project net MLVDS.Rx19_P]
Rx20_N: CON14.2 IC5.4(2B) R30.1 ; port MLVDS.Rx20_N  [project net MLVDS.Rx20_N]
Rx20_P: CON14.1 IC5.3(2A) R30.2 ; port MLVDS.Rx20_P  [project net MLVDS.Rx20_P]
SCL: IC1.14(SCL) ; port I2C.SCL  [project net MBUS.SCL]
SDA: IC1.15(SDA) ; port I2C.SDA  [project net MBUS.SDA]
Tx17_N: CON11.2 IC4.10(3B) R22.2 ; port MLVDS.Tx17_N  [project net MLVDS.Tx17_N]
Tx17_P: CON11.1 IC4.9(3A) R22.1 ; port MLVDS.Tx17_P  [project net MLVDS.Tx17_P]
Tx18_N: CON9.2 IC4.48(1B) R25.2 ; port MLVDS.Tx18_N  [project net MLVDS.Tx18_N]
Tx18_P: CON9.1 IC4.47(1A) R25.1 ; port MLVDS.Tx18_P  [project net MLVDS.Tx18_P]
Tx19_N: CON15.2 IC5.10(3B) R29.2 ; port MLVDS.Tx19_N  [project net MLVDS.Tx19_N]
Tx19_P: CON15.1 IC5.9(3A) R29.1 ; port MLVDS.Tx19_P  [project net MLVDS.Tx19_P]
Tx20_N: CON13.2 IC5.48(1B) R32.2 ; port MLVDS.Tx20_N  [project net MLVDS.Tx20_N]
Tx20_P: CON13.1 IC5.47(1A) R32.1 ; port MLVDS.Tx20_P  [project net MLVDS.Tx20_P]
NetIC4_30: IC4.30(PDN) R33.2
NetIC5_30: IC5.30(PDN) R34.2
NetJP1_1: JP1.1(E1) R1.2 R2.2
NetJP2_1: JP2.1(E1) R3.2 R4.2
NetJP3_1: JP3.1(E1) R5.2 R6.2
NetJP4_1: JP4.1(E1) R7.2 R8.2
NetJP5_1: JP5.1(E1) R9.2 R10.2
NetJP6_1: JP6.1(E1) R12.2 R13.2
NetJP7_1: JP7.1(E1) R15.2 R16.2
NetJP8_1: JP8.1(E1) R18.2 R19.2

Not connected (* = marked no-connect by the designer): IC1 13(~{INT}); IC4 17(nc) 44(nc); IC5 17(nc) 44(nc)

### Layout directives
differential pair: MLVDS.Rx17_N, MLVDS.Rx17_P, MLVDS.Rx18_N, MLVDS.Rx18_P, MLVDS.Rx19_N, MLVDS.Rx19_P, MLVDS.Rx20_N, MLVDS.Rx20_P, MLVDS.Tx17_N, MLVDS.Tx17_P, MLVDS.Tx18_N, MLVDS.Tx18_P, MLVDS.Tx19_N, MLVDS.Tx19_P, MLVDS.Tx20_N, MLVDS.Tx20_P

### Notes on the sheet
- Project/Equipment
- Document
- uTCA RTM 8 SFP+
- Designer
- Drawn by
- Check.by
- Copyright Creotech Instruments SA 2014.
  This documentation describes Open Hardware and is licensed under the CERN OHL v.1.1. You may redistribute and modify this documentation under the terms of the CERN OHL v.1.1. (http://ohwr.org/CERNOHL). This documentation is distributed WITHOUT ANY EXPRESS OR IMPLIED WARRANTY, INCLUDING OF MERCHANTABILITY, SATISFACTORY QUALITY AND FITNESS FOR A PARTICULAR PURPOSE. Please see the CERN OHL v.1.1 for applicable conditions.
- Creotech Instruments S.A.
- File
- Last Mod.
- Print Date
- Sheet
- Size
- A3
- of
- Rev
- (in symbol R0402_10K_1%_0.0625W_100PPM) 1%
- (in symbol R0402_100R_1%_0.0625W_100PPM) 1%

### Library data of the parts
C1-C24 = CC0201_100NF_6.3V_10%_X5R: as C27 on sheet CPU; Part Number: CC0201_100NF_6.3V_10%_X5R; Component Kind: Standard; Component Type: Standard; Pin Count: 2; Value: 100nF; Status: Not Recommended; Manufacturer Part Number: CC0201_100NF_6.3V_10%_X5R; Case: 0201; Mounted: Yes; Socket: No; SMD: Yes; Manufacturer1 Example: AVX; Manufacturer1 ComponentHeight: 0.33mm; HelpURL: \\cern.ch\dfs\Applications\Altium\Datasheets\CC0201_X5R_AVX.pdf; Author: CERN DEM JLC; CreateDate: 2007-12-03; LatestRevisionDate: 2007-12-03
CON1-CON8 = HUBER-SUHNER_85_SMA-50-0-101/111_NE: Part Description: SMA 50 Ohms Right Angle PCB Jack; Manufacturer: HUBER+SUHNER; Table: Miscellaneous; Part Number: HUBER-SUHNER_85_SMA-50-0-101/111_NE; Component Kind: Standard; Component Type: Standard; Pin Count: 2; Family: SMA; Mounted: Yes; Socket: No; SMD: No; Status: None; Manufacturer Part Number: 85_SMA-50-0-101/111_NE; ComponentHeight: 9.6mm; HelpURL: \\cern.ch\dfs\Applications\Altium\Datasheets\HUBER-SUHNER_85 SMA-50-0-101-111 NE.pdf; Author: CERN DEM JLC; CreateDate: 2010-04-20; LatestRevisionDate: 2010-04-27
CON9-CON16 = LEMO_EPG.00.302.NLN: Part Description: Size 00, Elbow Socket (90°) With 2 Female Contacts and Alignment Key (G); SCEM: 09.31.28.007.2; Part Number: LEMO_EPG.00.302.NLN; Component Kind: Standard; Component Type: Standard; Pin Count: 3; Family: LEMO 00; Mounted: Yes; Socket: No; SMD: No; Status: None; Manufacturer: LEMO; Manufacturer Part Number: EPG.00.302.NLN; ComponentHeight: 7mm; HelpURL: \\cern.ch\dfs\Applications\Altium\Datasheets\LEMO_EPG.00.302.NLN.pdf; Author: CERN DEM JLC; CreateDate: 2010-08-25; LatestRevisionDate: 2010-12-20; Table: LEMO
IC1 = PCF8574ADW: Remote 8-bit I/O Expander For I2C Bus; Manufacturer: TEXAS INSTRUMENTS; Table: Analog & Interface; Part Number: PCF8574ADW; Component Kind: Standard; Component Type: Standard; Device: PCF8574ADW; PackageDescription: SOIC 16, Pitch 1.27mm - Body 7.5x10.3mm, IPC Medium Density; Part Description: Remote 8-bit I/O Expander For I2C Bus; Manufacturer Part Number: PCF8574ADW; Pin Count: 16; Case: SOIC16W; Mounted: Yes; Socket: No; SMD: Yes; ComponentHeight: 2.65mm; Author: CERN DEM JLC; HelpURL: \\cern.ch\dfs\Applications\Altium\Datasheets\PCF8574ADW.pdf; CreateDate: 2012-11-01; LatestRevisionDate: 2012-11-01
IC2 IC3 = D_TVS_PESD3V3S4UD: 3.3V TVS
IC4 IC5 = IFC_SN65MLVD040
JP1-JP8 = JUMPER: Supplier 1: Farnell; Supplier Part Number 1: 1798942
R1-R19 R21 R23 R26 R28 R31 R33 R34 = R0402_10K_1%_0.0625W_100PPM: as R43 on sheet CPU; Part Number: R0402_10K_1%_0.0625W_100PPM; Component Kind: Standard; Component Type: Standard; Pin Count: 2; Value: 10k; Status: Not recommended; Power: 0.0625W; Tolerance: ±1%; Manufacturer Part Number: R0402_10K_1%_0.0625W_100PPM; Case: 0402; Mounted: Yes; Socket: No; SMD: Yes; Manufacturer1 Example: YAGEO PHYCOMP; Manufacturer1 ComponentHeight: 0.4mm; HelpURL: \\cern.ch\dfs\Applications\Altium\Datasheets\R0402_Phycomp_RC0402.pdf; Author: CERN DEM JLC; CreateDate: 2007-12-03; LatestRevisionDate: 2012-10-17
R20 R22 R24 R25 R27 R29 R30 R32 = R0402_100R_1%_0.0625W_100PPM: as R35 on sheet CPU; Part Number: R0402_100R_1%_0.0625W_100PPM; Component Kind: Standard; Component Type: Standard; Pin Count: 2; Value: 100; Status: Not recommended; Power: 0.0625W; Tolerance: ±1%; Manufacturer Part Number: R0402_100R_1%_0.0625W_100PPM; Case: 0402; Mounted: Yes; Socket: No; SMD: Yes; Manufacturer1 Example: YAGEO PHYCOMP; Manufacturer1 ComponentHeight: 0.4mm; HelpURL: \\cern.ch\dfs\Applications\Altium\Datasheets\R0402_Phycomp_RC0402.pdf; Author: CERN DEM JLC; CreateDate: 2007-12-03; LatestRevisionDate: 2012-10-17
SW1 = COMATEL_313.1730.0.00.40.0: Jumper 1 Pin; Part Description: Closed Insulated Black Jumper Pitch 2.54mm; Manufacturer: KONTEK COMATEL; SCEM: 09.55.10.960.9; Table: STELVIO-KONTEK COMATEL; Part Number: COMATEL_313.1730.0.00.40.0; Component Kind: Standard; Component Type: Standard; Pin Count: 1; Family: Jumper; Mounted: Yes; Socket: No; SMD: No; Status: Obsolete; Manufacturer Part Number: 313.1730.0.00.40.0; ComponentHeight: 6.5mm; HelpURL: \\cern.ch\dfs\Applications\Altium\Datasheets\COMATEL_313.1730.0.00.40.0.pdf; Author: CERN DEM JLC; CreateDate: 2008-04-09; LatestRevisionDate: 2013-08-27
W1 = COMATEL_385.0358.1.02.400: 2 Mini Wire-Wrap Contact Strip Header; Part Description: 2 Contacts Straight Strip Header Pitch 2.54mm L=6.3mm ''Mini-Wire-Wrap''; Manufacturer: KONTEK COMATEL; Table: STELVIO-KONTEK COMATEL; Part Number: COMATEL_385.0358.1.02.400; Component Kind: Standard; Component Type: Standard; Pin Count: 2; Family: Test Point; Mounted: Yes; Socket: No; SMD: No; Status: Not recommended; Manufacturer Part Number: 385.0358.1.02.400; ComponentHeight: 8mm; HelpURL: \\cern.ch\dfs\Applications\Altium\Datasheets\COMATEL_385.0358.1.02.400.pdf; Author: CERN DEM JLC; CreateDate: 2010-06-30; LatestRevisionDate: 2012-10-10